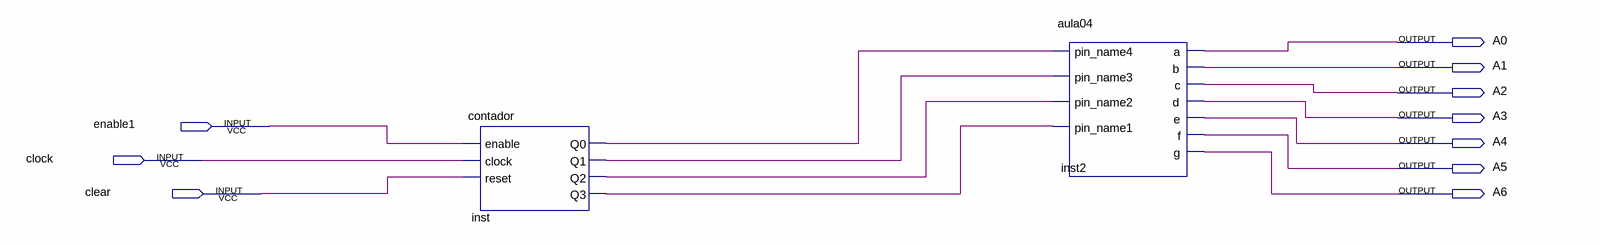
[diagram p0: schematic sheet]
// Quartus schematic parte3.bdf as structural Verilog: 2 symbols, 10 pins
module parte3 (
  input  enable1,
  input  clock,
  input  clear,
  output A0,
  output A1,
  output A2,
  output A3,
  output A4,
  output A5,
  output A6
);

  wire inst_q0, inst_q1, inst_q2, inst_q3;

  contador inst (
    .enable(enable1), .clock(clock), .reset(clear), .Q0(inst_q0), .Q1(inst_q1), .Q2(inst_q2), .Q3(inst_q3));
  aula04 inst2 (
    .pin_name1(inst_q3), .pin_name4(inst_q0), .pin_name2(inst_q2), .pin_name3(inst_q1), .a(A0), .b(A1),
    .c(A2), .d(A3), .e(A4), .f(A5), .g(A6));
endmodule
